# EAGLE design rgb-led-a (EAGLE 7.6.0)
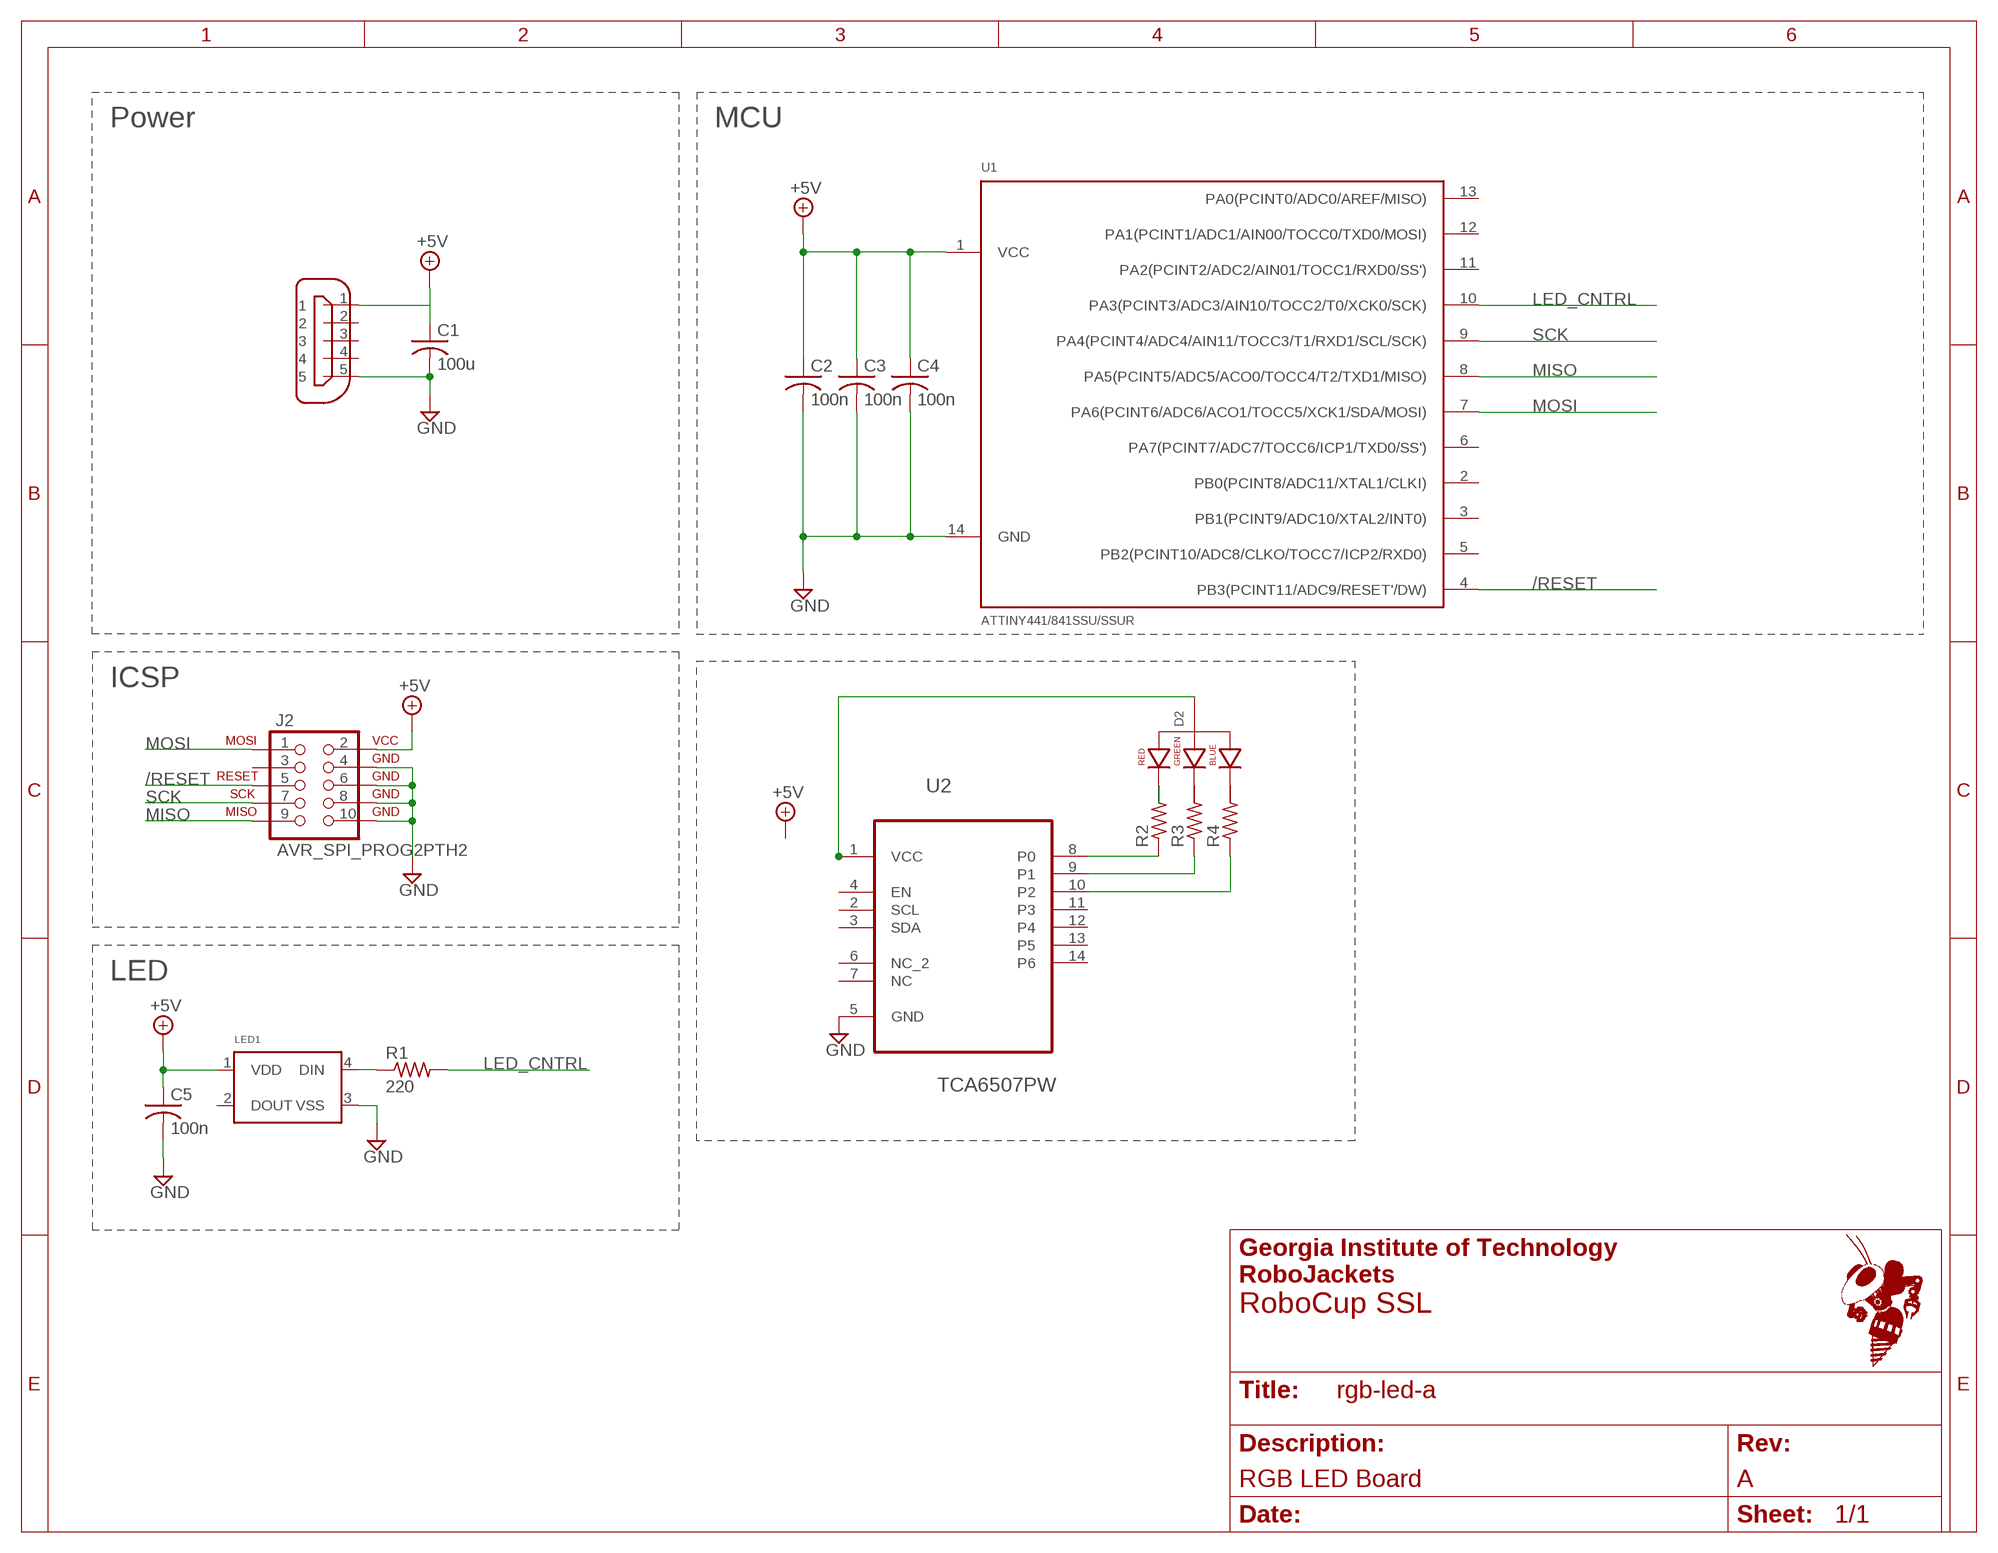
[diagram p0: schematic, sheet 1]
FRAME1 (FRAME_A_L): REVISION: A; SCH_DESC: RGB LED Board; TEAM: RoboCup SSL

## Parts
C1  100u  C-USC1206  [C1206]
C2  100n  C-USC0603  [C0603]
C3  100n  C-USC0603  [C0603]
C4  100n  C-USC0603  [C0603]
C5  100n  C-USC0603  [C0603]
D2  LED-RGB-CA-THRUCLEAR  [LED-RGB-THRU]
J1  MICRO-USB  [GS-14-2180]
J2  AVR_SPI_PROG2PTH2  [2X5-SHROUDED]
LED1  WS2812B  [5050]
R1  220  R-US_R0603  [R0603]
R2  R-US_R0805  [R0805]
R3  R-US_R0805  [R0805]
R4  R-US_R0805  [R0805]
U1  ATTINY441/841SSU/SSUR  [SOIC-14]
U2  TCA6507PW  [SOP65P640X120-14N]

## Nets
+5V: C1.1 C2.1 C3.1 C4.1 C5.1 J1.1 J2.2(VCC) LED1.1(VDD) U1.1(VCC)
/RESET: J2.5(RESET) U1.4(PB3(PCINT11/ADC9/RESET'/DW))
GND: C1.2 C2.2 C3.2 C4.2 C5.2 J1.5 J2.4(GND) J2.6(GND) J2.8(GND) J2.10(GND) LED1.3(VSS) U1.14(GND) U2.5(GND)
LED_CNTRL: R1.2 U1.10(PA3(PCINT3/ADC3/AIN10/TOCC2/T0/XCK0/SCK))
MISO: J2.9(MISO) U1.8(PA5(PCINT5/ADC5/ACO0/TOCC4/T2/TXD1/MISO))
MOSI: J2.1(MOSI) U1.7(PA6(PCINT6/ADC6/ACO1/TOCC5/XCK1/SDA/MOSI))
N$1: LED1.4(DIN) R1.1
N$2: D2.1(RED_CATHODE) R2.2
N$3: R2.1 U2.8(P0)
N$4: R3.1 U2.9(P1)
N$5: R4.1 U2.10(P2)
N$6: D2.2(ANODE) U2.1(VCC)
SCK: J2.7(SCK) U1.9(PA4(PCINT4/ADC4/AIN11/TOCC3/T1/RXD1/SCL/SCK))
Unconnected: D2.3(GREEN_CATHODE) D2.4(BLUE_CATHODE) J1.2 J1.3 J1.4 J2.3(NC) LED1.2(DOUT) R3.2 R4.2 U1.2(PB0(PCINT8/ADC11/XTAL1/CLKI)) U1.3(PB1(PCINT9/ADC10/XTAL2/INT0)) U1.5(PB2(PCINT10/ADC8/CLKO/TOCC7/ICP2/RXD0)) U1.6(PA7(PCINT7/ADC7/TOCC6/ICP1/TXD0/SS')) U1.11(PA2(PCINT2/ADC2/AIN01/TOCC1/RXD0/SS')) U1.12(PA1(PCINT1/ADC1/AIN00/TOCC0/TXD0/MOSI)) U1.13(PA0(PCINT0/ADC0/AREF/MISO)) U2.2(SCL) U2.3(SDA) U2.4(EN) U2.6(NC_2) U2.7(NC) U2.11(P3) U2.12(P4) U2.13(P5) U2.14(P6)

## Notes on the sheet
- Power | MCU
- ICSP
- LED

## Library data of the parts
C1-C5 = rcl:C-US: CAPACITOR, American symbol
D2 = SparkFun-LED:LED-RGB-CA-THRU: RGB Through-hole common anode SparkFun store front COM-10821 (diffuse) COM-10820 (clear); PROD_ID: DIO-10631
J1 = micro-usb-1:MICRO-USB
J2 = SparkFun-Connectors:AVR_SPI_PROG2: AVR 10-pin ICSP Header This is the standard AVR In Circuit Serial Programming header. Minimal, but includes pin one indicator. Works with standard Olimex programmers. Also look for the 6-pin reduced version. Spark Fun Electronics SKU: PRT-00778
LED1 = RoboJackets-LEDs:WS2812B: WS2812B 5050 RGB LED with Integrated Driver Chip http://www.adafruit.com/products/1655
R1 = rcl:R-US_: RESISTOR, American symbol
R2-R4 = resistor:R-US_: RESISTOR, American symbol
U1 = RoboJackets-ICs:ATTINY441/841
U2 = Texas Instruments_By_element14_Batch_1:TCA6507PW: LOW-VOLTAGE 7-BIT I2C AND SMBus LED DRIVER WITH INTENSITY CONTROL AND SHUTDOWN; MPN: TCA6507PW; OC_FARNELL: 1647813; OC_NEWARK: 54M7301; PACKAGE: TSSOP-14; SUPPLIER: Texas Instruments

## Board
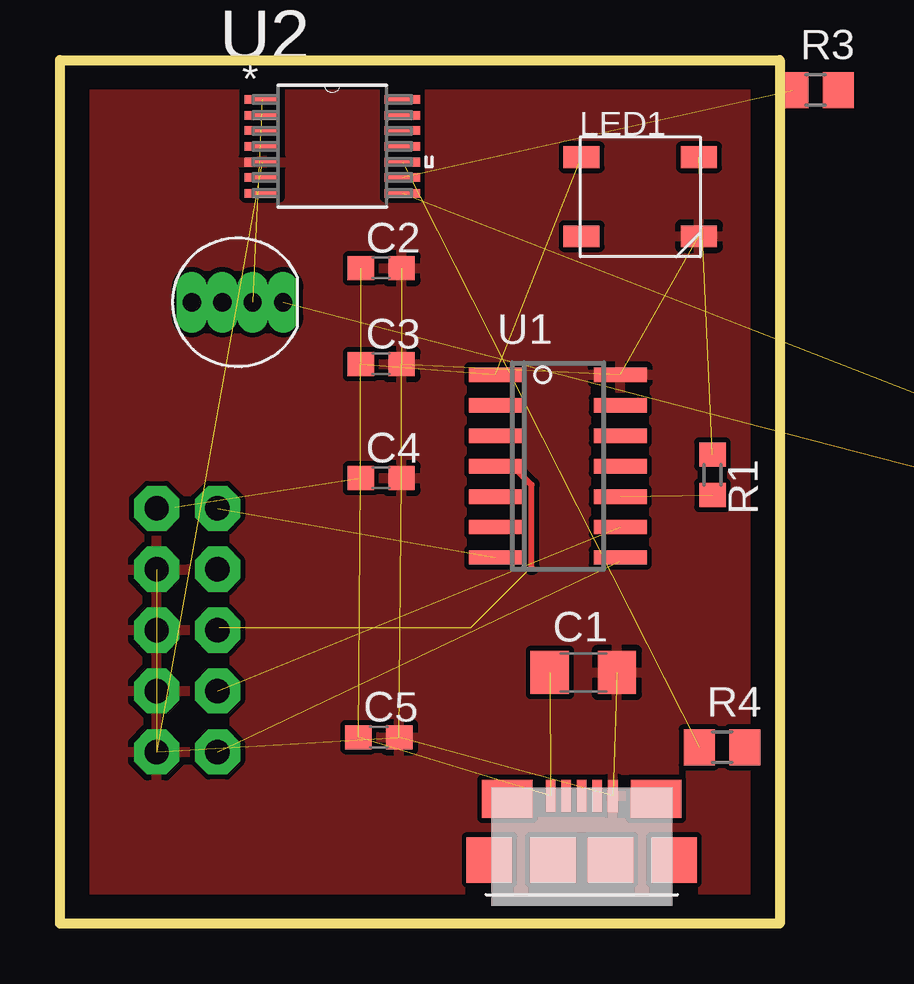
[diagram p1: board, top side]
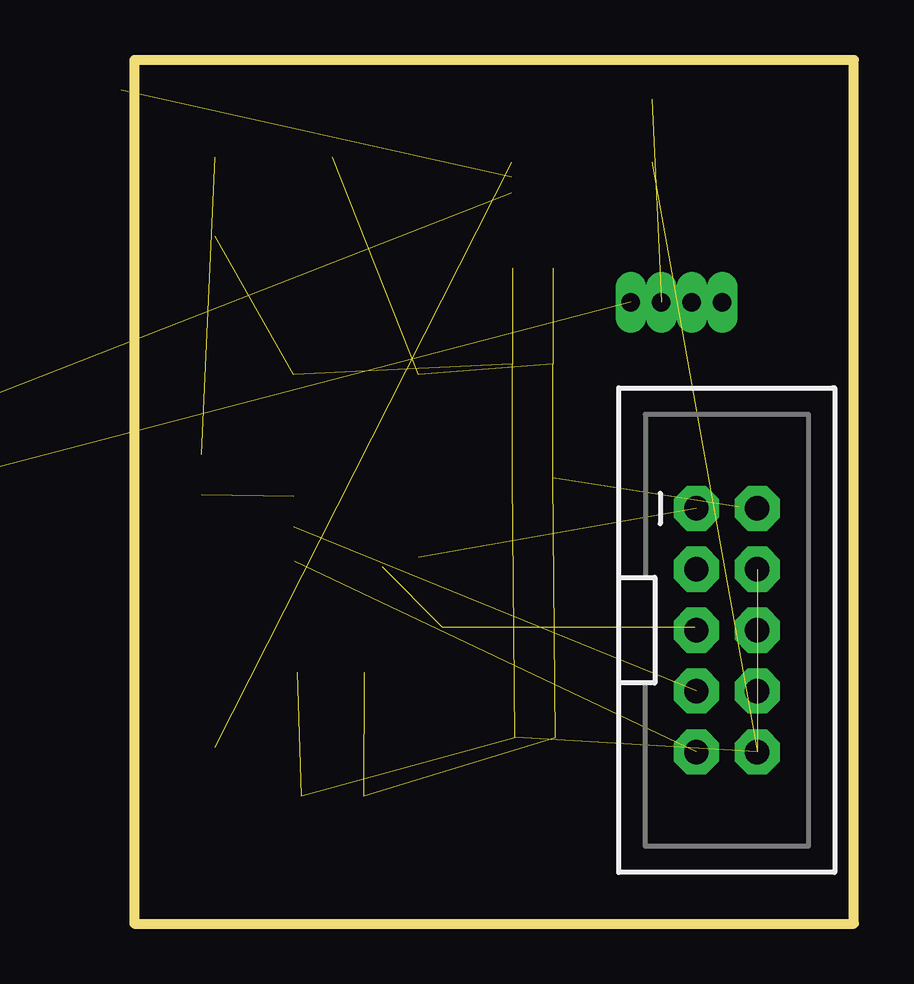
[diagram p2: board, bottom side, seen from below]

Size 30 x 36 mm. Coordinates in mm from the lower left corner, seen from the top.
Outline: 0,0 0,36 30,36 30,0 0,0
Copper layers (1*16): Top 0.035mm / dielectric 1.5mm / Bottom 0.035mm
Design rules "default": minimum track width 10mil, minimum drill 24mil, track to track 8mil, track to pad 8mil, pad to pad 8mil, via to via 8mil, smd to smd 8mil, copper to edge 40mil, drill to drill 8mil, minimum pad ring 10mil, minimum via ring 8mil, stop-mask expansion 4mil, vias tented up to drill 0mil, thermal gap 10mil

### Footprints (pad centres in the part's own frame; a part is rotated, then mirrored left to right if it is on the bottom)
C1206 = smd 1.6 x 1.8: 1 -1.4,0; 2 1.4,0
C0603 = smd 1.1 x 1: 1 -0.85,0; 2 0.85,0
LED-RGB-THRU = drill 0.762 pad 0.889 long: 1 1.905,0; 2 0.635,0; 3 -0.635,0; 4 -1.905,0
GS-14-2180 = smd 0.4 x 1.35: 1 -1.3,2.675; 2 -0.65,2.675; 3 0,2.675; 4 0.65,2.675; 5 1.3,2.675 | smd 1.9 x 1.9: P$1 1.2,0; P$2 -1.2,0; P$3 3.85,0; P$4 -3.85,0 | smd 2.1 x 1.6: P$10 3.1,2.55; P$11 -3.1,2.55
2X5-SHROUDED = drill 1.016 pad 1.88 octagon: 1 -1.27,5.08; 2 1.27,5.08; 3 -1.27,2.54; 4 1.27,2.54; 5 -1.27,0; 6 1.27,0; 7 -1.27,-2.54; 8 1.27,-2.54; 9 -1.27,-5.08; 10 1.27,-5.08
5050 = smd 1.5 x 0.9: 1 -2.45,1.65; 2 -2.45,-1.65; 3 2.45,-1.65; 4 2.45,1.65
R0603 = smd 1 x 1.1: 1 -0.85,0; 2 0.85,0
R0805 = smd 1.3 x 1.5: 1 -0.95,0; 2 0.95,0
SOIC-14 = smd 0.6 x 2.2: 1 -3.81,-2.6; 2 -2.54,-2.6; 3 -1.27,-2.6; 4 0,-2.6; 5 1.27,-2.6; 6 2.54,-2.6; 7 3.81,-2.6; 8 3.81,2.6; 9 2.54,2.6; 10 1.27,2.6; 11 0,2.6; 12 -1.27,2.6; 13 -2.54,2.6; 14 -3.81,2.6
SOP65P640X120-14N = smd 1.473 x 0.356: 1 -2.921,1.956; 2 -2.921,1.295; 3 -2.921,0.66; 4 -2.921,0; 5 -2.921,-0.66; 6 -2.921,-1.295; 7 -2.921,-1.956; 8 2.921,-1.956; 9 2.921,-1.295; 10 2.921,-0.66; 11 2.921,0; 12 2.921,0.66; 13 2.921,1.295; 14 2.921,1.956

### Placement (x,y rotation side)
C1  21.82,10.47 0 top
C2  13.39,27.32 0 top
C3  13.39,23.32 0 top
C4  13.39,18.57 0 top
C5  13.29,7.77 0 top
D2  7.4,25.9 0 top
J1  21.75,2.65 0 top
J2  5.3,12.23 0 bottom
LED1  24.19,30.3 0 top
R1  27.2,18.71 270 top
R2  54.75,14.3 180 top  (outside the outline)
R3  31.5,34.75 0 top
R4  27.6,7.35 0 top
U1  20.76,19.07 270 top
U2  11.35,32.4 0 top

### Tracks (layer width: path | path; a pad name or v marks a point on that pad's centre or on a via)
+5V  (8 unrouted)
  Top 0.254: 4.8,17.37 4.12,17.37 J2.2
/RESET  (2 unrouted)
  Top 0.254: 19.66,14.86 19.66,18.29 18.97,18.97 18.29,18.97 U1.4 | 6.63,12.34 J2.5
GND  (12 unrouted)
  pour Top: 0.6,0.45 0.6,35.3 29.35,35.3 29.35,0.45
LED_CNTRL  (1 unrouted)
MISO  (1 unrouted)
  Top 0.254: 23.32,15.09 U1.8
MOSI  (1 unrouted)
N$1  (1 unrouted)
N$2  (1 unrouted)
N$3  (1 unrouted)
N$4  (1 unrouted)
N$5  (1 unrouted)
N$6  (1 unrouted)
SCK  (1 unrouted)